# Altium schematic sheet 04-POWER.SchDoc
size 246 x 182 mm
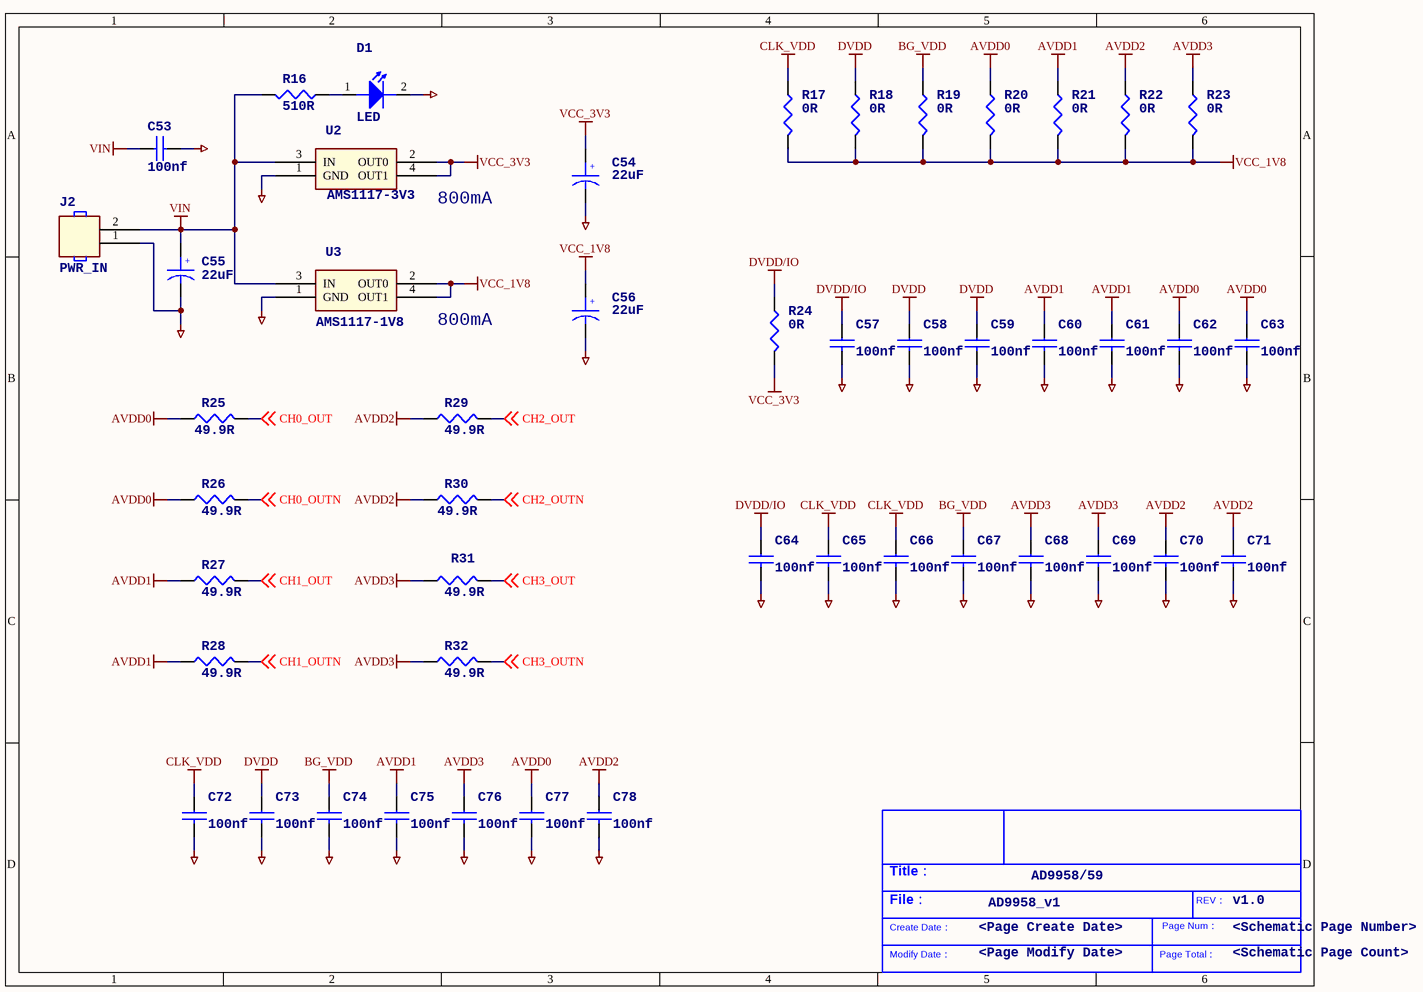
[diagram p0: 04-POWER.SchDoc]

## Parts
*  Schematic Page Count: <Schematic Page Count>  Schematic Page Number: <Schematic Page Number>  Page Modify Date: <Page Modify Date>  Page Create Date: <Page Create Date>  Revcode: v1.0  File: AD9958_v1  Title: AD9958/59  (hidden comment: My_Title_Block)  (graphical)
C53  100nf  [0603C]
C54  22uF  [1206T]
C55  22uF  [1206T]
C56  22uF  [1206T]
C57  100nf  [0603C]
C58  100nf  [0603C]
C59  100nf  [0603C]
C60  100nf  [0603C]
C61  100nf  [0603C]
C62  100nf  [0603C]
C63  100nf  [0603C]
C64  100nf  [0603C]
C65  100nf  [0603C]
C66  100nf  [0603C]
C67  100nf  [0603C]
C68  100nf  [0603C]
C69  100nf  [0603C]
C70  100nf  [0603C]
C71  100nf  [0603C]
C72  100nf  [0603C]
C73  100nf  [0603C]
C74  100nf  [0603C]
C75  100nf  [0603C]
C76  100nf  [0603C]
C77  100nf  [0603C]
C78  100nf  [0603C]
D1  LED  [0603D]
J2  PWR_IN  [KF2EDG_3R81_2P]
R16  510R  [0603R]
R17  0R  [0603R]
R18  0R  [0603R]
R19  0R  [0603R]
R20  0R  [0603R]
R21  0R  [0603R]
R22  0R  [0603R]
R23  0R  [0603R]
R24  0R  [0603R]
R25  49.9R  [0603R]
R26  49.9R  [0603R]
R27  49.9R  [0603R]
R28  49.9R  [0603R]
R29  49.9R  [0603R]
R30  49.9R  [0603R]
R31  49.9R  [0603R]
R32  49.9R  [0603R]
U2  AMS1117-3V3  [SOT223]
U3  AMS1117-1V8  [SOT223]

## Nets
AGND: C53.2 C54.2 C55.2 C56.2 C57.2 C58.2 C59.2 C60.2 C61.2 C62.2 C63.2 C64.2 C65.2 C66.2 C67.2 C68.2 C69.2 C70.2 C71.2 C72.2 C73.2 C74.2 C75.2 C76.2 C77.2 C78.2 D1.2(K) J2.1 U2.1(GND) U3.1(GND)
AVDD0: C62.1 C63.1 C77.1 R20.1 R25.1 R26.1
AVDD1: C60.1 C61.1 C75.1 R21.1 R27.1 R28.1
AVDD2: C70.1 C71.1 C78.1 R22.1 R29.1 R30.1
AVDD3: C68.1 C69.1 C76.1 R23.1 R31.1 R32.1
BG_VDD: C67.1 C74.1 R19.1
CLK_VDD: C65.1 C66.1 C72.1 R17.1
DVDD: C58.1 C59.1 C73.1 R18.1
DVDD/IO: C57.1 C64.1 R24.1
VCC_1V8: C56.1 R17.2 R18.2 R19.2 R20.2 R21.2 R22.2 R23.2 U3.2(OUT0) U3.4(OUT1)
VCC_3V3: C54.1 R24.2 U2.2(OUT0) U2.4(OUT1)
VIN: C53.1 C55.1 J2.2 R16.2 U2.3(IN) U3.3(IN)
CH0_OUT: R25.2 ; off-sheet CH0_OUT
CH0_OUTN: R26.2 ; off-sheet CH0_OUTN
CH1_OUT: R27.2 ; off-sheet CH1_OUT
CH1_OUTN: R28.2 ; off-sheet CH1_OUTN
CH2_OUT: R29.2 ; off-sheet CH2_OUT
CH2_OUTN: R30.2 ; off-sheet CH2_OUTN
CH3_OUT: R31.2 ; off-sheet CH3_OUT
CH3_OUTN: R32.2 ; off-sheet CH3_OUTN
NetD1_1: D1.1(A) R16.1

## Notes on the sheet
- (near U2) 800mA
- (near U3) 800mA
- (in symbol CAP POL) +
- (in symbol My_Title_Block) Title：; REV：; File：; Create Date：; Page Num：; Modify Date：; Page Total：

## Library data of the parts
* = My_Title_Block: Company Name: 东莞理工学院; Page Count: 4; Page Number: 4
C53 C57-C78 = CAP NP
C54-C56 = CAP POL
D1 = LED: pin to pad: 1>2 2>1
J2 = HEADER 2
R16-R32 = R
U3 = AMS1117-3V3